# Altium schematic sheet Sheet1.SchDoc
size A4; SheetNumber: 1; SheetTotal: 1
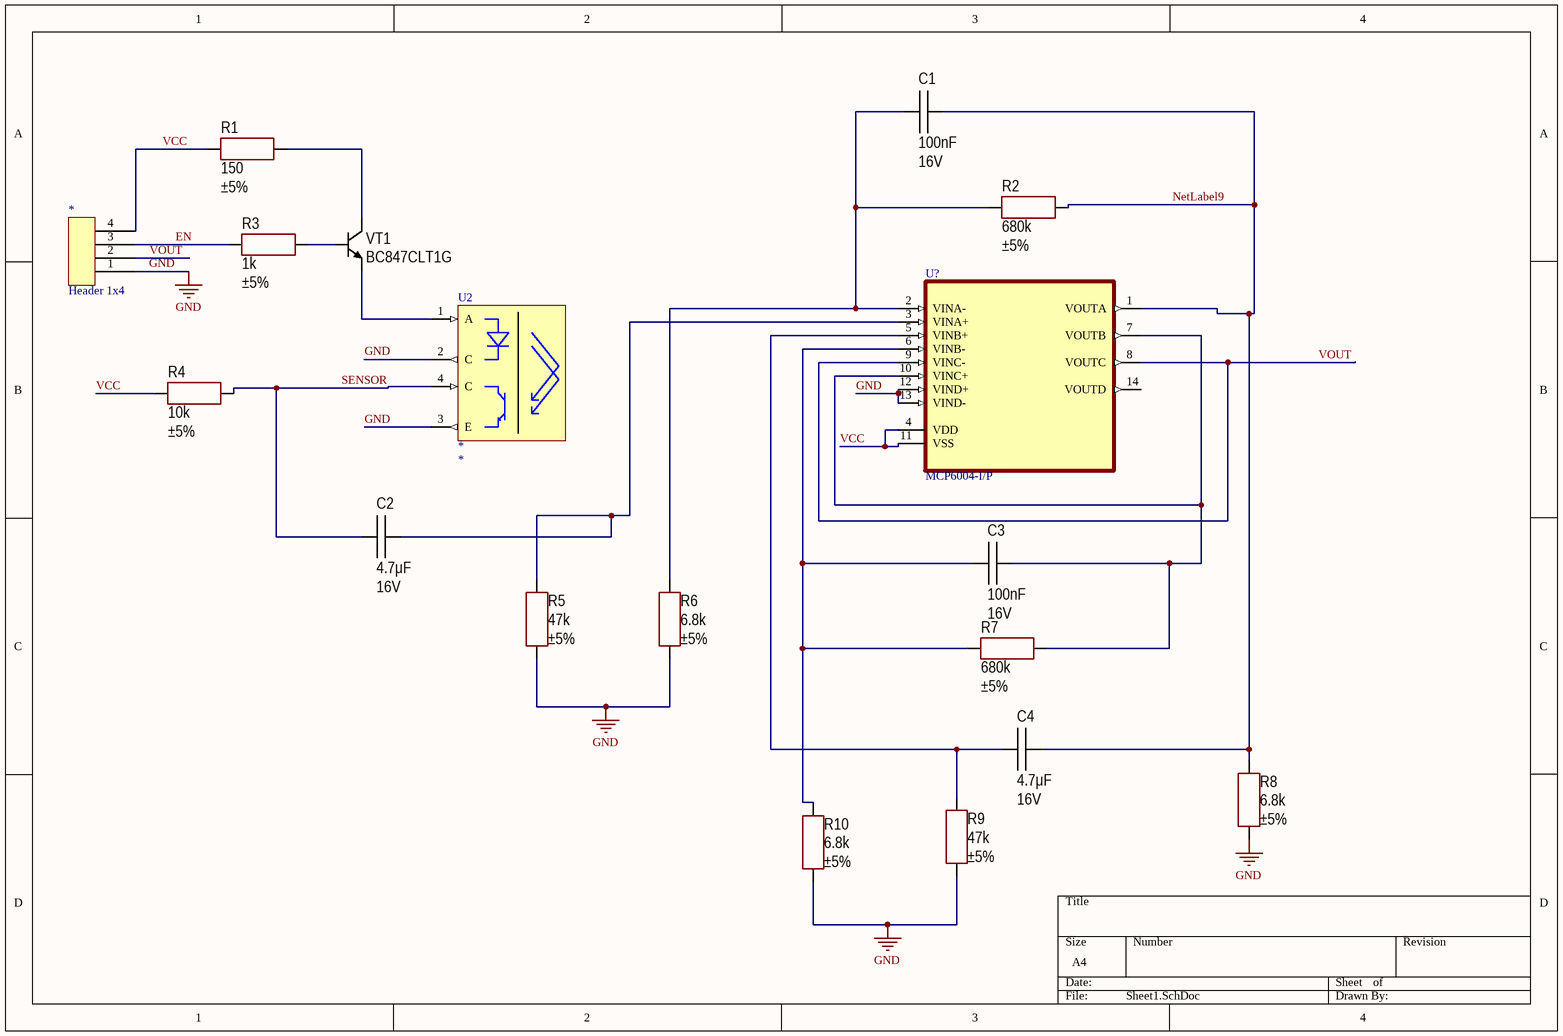
[diagram p0: Sheet1.SchDoc]

## Parts
*  Header 1x4  [Header 1x4 male]
C1  value 100nF  Voltage: 16V  [CAP: 0201]
C2  value 4.7μF  Voltage: 16V  [CAP: 0201]
C3  value 100nF  Voltage: 16V  [CAP: 0201]
C4  value 4.7μF  Voltage: 16V  [CAP: 0201]
R1  value 150  Tolerance: ±5%  [RES: 0402]
R2  value 680k  Tolerance: ±5%  [RES: 0402]
R3  value 1k  Tolerance: ±5%  [RES: 0402]
R4  value 10k  Tolerance: ±5%  [RES: 0402]
R5  value 47k  Tolerance: ±5%  [RES: 0402]
R6  value 6.8k  Tolerance: ±5%  [RES: 0402]
R7  value 680k  Tolerance: ±5%  [RES: 0402]
R8  value 6.8k  Tolerance: ±5%  [RES: 0402]
R9  value 47k  Tolerance: ±5%  [RES: 0402]
R10  value 6.8k  Tolerance: ±5%  [RES: 0402]
U2  U_TCRT10X0  [TCRT1000]  (value not drawn)
U?  MCP6004-I/P  [DIP254P762X533-14]
VT1  PartNumber: BC847CLT1G  [DPAK]

## Nets
GND: *.1 R5.1 R6.1 R8.1 R9.1 R10.1 U2.2(C) U2.3(E) U?.12(VIND+) U?.13(VIND-)
EN: *.3 R3.1
NetLabel9: C1.1 C4.2 R2.1 R8.2 U?.1(VOUTA)
SENSOR: C2.2 R4.2 U2.4(C)
VCC: *.4 R1.1 R4.1 U?.4(VDD) U?.11(VSS)
VOUT: *.2 U?.8(VOUTC) U?.9(VINC-)
NetC1_2: C1.2 R2.2 R6.2 U?.2(VINA-)
NetC2_1: C2.1 R5.2 U?.3(VINA+)
NetC3_1: C3.1 R7.2 R10.2 U?.6(VINB-)
NetC3_2: C3.2 R7.1 U?.7(VOUTB) U?.10(VINC+)
NetC4_1: C4.1 R9.2 U?.5(VINB+)
NetR1_2: R1.2 VT1.2(C)
NetR3_2: R3.2 VT1.1(B)
NetU2_1: U2.1(A) VT1.3(E)

Not connected (* = marked no-connect by the designer): U? 14(VOUTD)

## Notes on the sheet
- Labels drawn without touching a wire or pin: GND

## Library data of the parts
C1 C3 = Ceramic_0201: Manufacturer: Yageo; PartNumber: CC0201KRX7R7BB103; ValueManufacturerPartNumber: Ceramic capacitor, 100nF, X7R, ±10%, 16V, 0201, -55...+125°C; TypeCapacitor: Ceramic capacitor; Tolerance: ±10%; TypeDielectric: X7R; Package: 0201; HelpURL: https://www.digikey.com/product-detail/en/yageo/CC0201KRX7R7BB103/311-1404-1-ND/2833710; Temperature: -55...+125°C
C2 C4 = Ceramic_0201: Manufacturer: Yageo; PartNumber: CC0201KRX7R7BB103; ValueManufacturerPartNumber: Ceramic capacitor, 4.7μF, X7R, ±10%, 16V, 0201, -55...+125°C; TypeCapacitor: Ceramic capacitor; Tolerance: ±10%; TypeDielectric: X7R; Package: 0201; HelpURL: https://www.digikey.com/product-detail/en/yageo/CC0201KRX7R7BB103/311-1404-1-ND/2833710; Temperature: -55...+125°C
R1 = Resistor_0402: Manufacturer: Yageo; PartNumber: RC0402JR-07100RL; ValueManufacturerPartNumber: Resistor film, 150, ±5%, 0402, 0.063W, -55...+125°C; TypeResistor: Resistor film; Power: 0.063W; Package: 0402; HelpURL: https://www.digikey.com/product-detail/en/yageo/RC0402JR-07100RL/311-100JRCT-ND/729362; Temperature: -55...+125°C
R2 R7 = Resistor_0402: Manufacturer: Yageo; PartNumber: RC0402JR-07100RL; ValueManufacturerPartNumber: Resistor film, 680k, ±5%, 0402, 0.063W, -55...+125°C; TypeResistor: Resistor film; Power: 0.063W; Package: 0402; HelpURL: https://www.digikey.com/product-detail/en/yageo/RC0402JR-07100RL/311-100JRCT-ND/729362; Temperature: -55...+125°C
R3 = Resistor_0402: Manufacturer: Yageo; PartNumber: RC0402JR-07100RL; ValueManufacturerPartNumber: Resistor film, 1k, ±5%, 0402, 0.063W, -55...+125°C; TypeResistor: Resistor film; Power: 0.063W; Package: 0402; HelpURL: https://www.digikey.com/product-detail/en/yageo/RC0402JR-07100RL/311-100JRCT-ND/729362; Temperature: -55...+125°C
R4 = Resistor_0402: Manufacturer: Yageo; PartNumber: RC0402JR-07100RL; ValueManufacturerPartNumber: Resistor film, 10k, ±5%, 0402, 0.063W, -55...+125°C; TypeResistor: Resistor film; Power: 0.063W; Package: 0402; HelpURL: https://www.digikey.com/product-detail/en/yageo/RC0402JR-07100RL/311-100JRCT-ND/729362; Temperature: -55...+125°C
R5 R9 = Resistor_0402: Manufacturer: Yageo; PartNumber: RC0402JR-07100RL; ValueManufacturerPartNumber: Resistor film, 47k, ±5%, 0402, 0.063W, -55...+125°C; TypeResistor: Resistor film; Power: 0.063W; Package: 0402; HelpURL: https://www.digikey.com/product-detail/en/yageo/RC0402JR-07100RL/311-100JRCT-ND/729362; Temperature: -55...+125°C
R6 R8 R10 = Resistor_0402: Manufacturer: Yageo; PartNumber: RC0402JR-07100RL; ValueManufacturerPartNumber: Resistor film, 6.8k, ±5%, 0402, 0.063W, -55...+125°C; TypeResistor: Resistor film; Power: 0.063W; Package: 0402; HelpURL: https://www.digikey.com/product-detail/en/yageo/RC0402JR-07100RL/311-100JRCT-ND/729362; Temperature: -55...+125°C
U? = MCP6004-I/P: Microchip , Quad Op Amp, 1MHz CMOS, Rail to Rail, 3V, 5V, 14-Pin PDIP | Microchip Technology Inc. MCP6004-I/P; SnapEDA_Link: https://www.snapeda.com/parts/MCP6004-I/P/Microchip/view-part/?ref=snap; Package: DIP-14 Microchip; Value: *; MF: Microchip; MP: MCP6004-I/P; Check_prices: https://www.snapeda.com/parts/MCP6004-I/P/Microchip/view-part/?ref=eda
VT1 = BJT_NPN_123: Manufacturer: ON Semiconductor; ValueManufacturerPartNumber: NPN transistor, 45V, 100mA, 100MHz, 300mW, 0.6V, 420, SOT-23, -55...+125°C; TypeTransistor: NPN transistor; VoltageCE: 45V; CurrentCE: 100mA; VoltageSaturation: 0.6V; Frequency: 100MHz; CurrentGain: 420; MaxPower: 300mW; Package: SOT-23; HelpURL: https://www.digikey.com/product-detail/en/on-semiconductor/BC847CLT1G/BC847CLT1GOSCT-ND/917836; Temperature: -55...+125°C
U2 = U_TCRT10X0: Value: *; SCH_Footprint: *